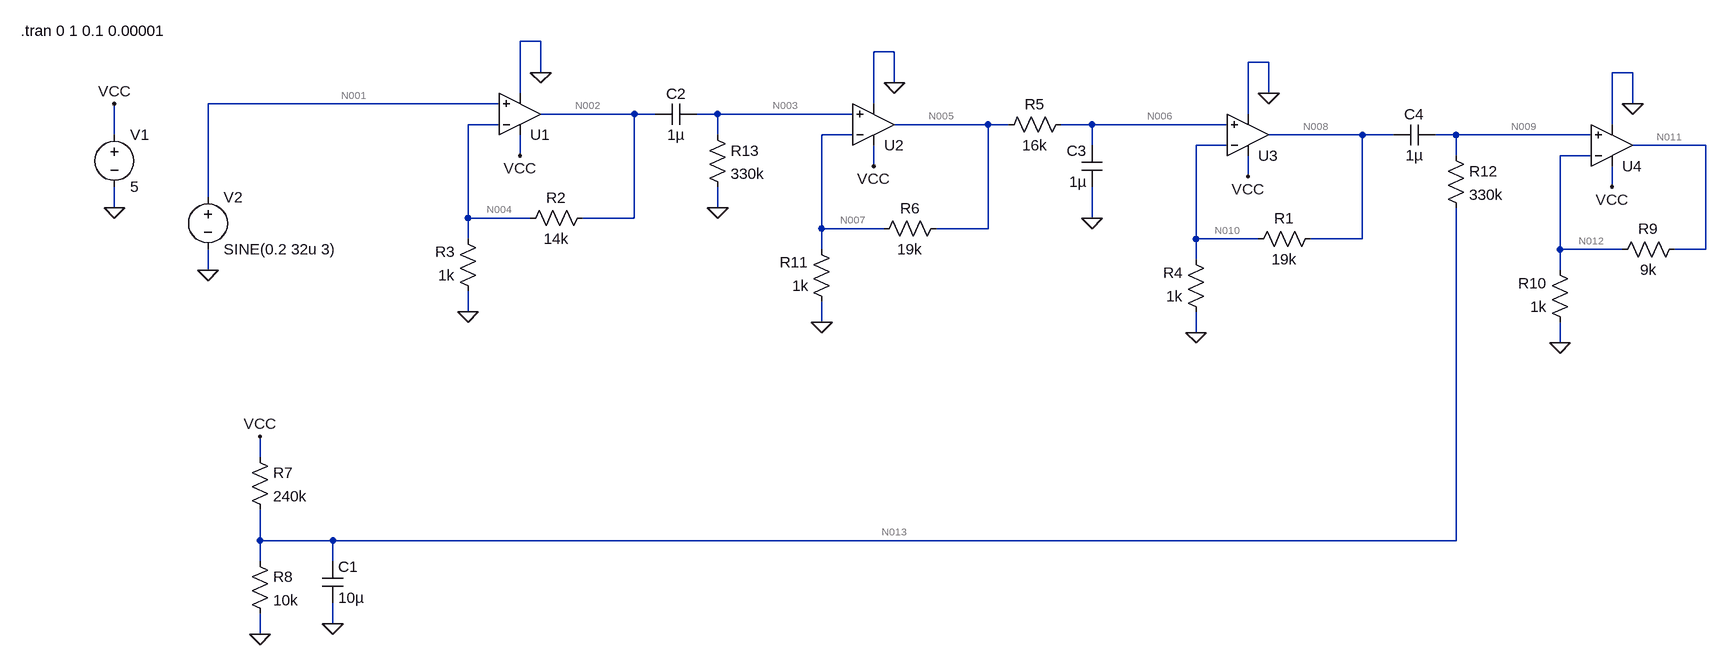
[diagram p0: schematic Draft1.asc]
Draft1.asc, the LTspice schematic file:
Version 4.1
SHEET 1 3092 772
WIRE 400 -288 368 -288
WIRE 944 -272 912 -272
WIRE 1520 -256 1488 -256
WIRE 400 -240 400 -288
WIRE 2080 -240 2048 -240
WIRE 944 -224 944 -272
WIRE 368 -208 368 -288
WIRE 1520 -208 1520 -256
WIRE 336 -192 -112 -192
WIRE 912 -192 912 -272
WIRE 2080 -192 2080 -240
WIRE 544 -176 400 -176
WIRE 576 -176 544 -176
WIRE 672 -176 640 -176
WIRE 880 -176 672 -176
WIRE 1488 -176 1488 -256
WIRE 336 -160 288 -160
WIRE 1088 -160 944 -160
WIRE 1120 -160 1088 -160
WIRE 1248 -160 1200 -160
WIRE 1456 -160 1248 -160
WIRE 2048 -160 2048 -240
WIRE -256 -144 -256 -192
WIRE 672 -144 672 -176
WIRE 880 -144 832 -144
WIRE 1664 -144 1520 -144
WIRE 1712 -144 1664 -144
WIRE 1808 -144 1776 -144
WIRE 2016 -144 1808 -144
WIRE 1248 -128 1248 -160
WIRE 1456 -128 1408 -128
WIRE 2192 -128 2080 -128
WIRE 368 -112 368 -144
WIRE 1808 -112 1808 -144
WIRE 2016 -112 1968 -112
WIRE 912 -96 912 -128
WIRE 1488 -80 1488 -112
WIRE 2048 -64 2048 -96
WIRE -112 -48 -112 -192
WIRE -256 -32 -256 -64
WIRE 672 -32 672 -64
WIRE 288 -16 288 -160
WIRE 384 -16 288 -16
WIRE 544 -16 544 -176
WIRE 544 -16 464 -16
WIRE 1248 -16 1248 -64
WIRE 832 0 832 -144
WIRE 928 0 832 0
WIRE 1088 0 1088 -160
WIRE 1088 0 1008 0
WIRE 288 16 288 -16
WIRE 1408 16 1408 -128
WIRE 1504 16 1408 16
WIRE 1664 16 1664 -144
WIRE 1664 16 1584 16
WIRE 832 32 832 0
WIRE 1968 32 1968 -112
WIRE 2064 32 1968 32
WIRE 2192 32 2192 -128
WIRE 2192 32 2144 32
WIRE 1408 48 1408 16
WIRE -112 64 -112 32
WIRE 1968 64 1968 32
WIRE 288 128 288 96
WIRE 832 144 832 112
WIRE 1408 160 1408 128
WIRE 1968 176 1968 144
WIRE -32 352 -32 320
WIRE -32 480 -32 432
WIRE 80 480 -32 480
WIRE 1808 480 1808 -32
WIRE 1808 480 80 480
WIRE -32 512 -32 480
WIRE 80 512 80 480
WIRE 80 608 80 576
WIRE -32 624 -32 592
FLAG -256 -32 0
FLAG -256 -192 VCC
FLAG -112 64 0
FLAG 368 -112 VCC
FLAG 400 -240 0
FLAG 288 128 0
FLAG 912 -96 VCC
FLAG 944 -224 0
FLAG 832 144 0
FLAG 1488 -80 VCC
FLAG 1520 -208 0
FLAG 1408 160 0
FLAG 1248 -16 0
FLAG 80 608 0
FLAG -32 624 0
FLAG -32 320 VCC
FLAG 672 -32 0
FLAG 2048 -64 VCC
FLAG 2080 -192 0
FLAG 1968 176 0
SYMBOL voltage -256 -160 R0
WINDOW 123 0 0 Left 0
WINDOW 39 0 0 Left 0
SYMATTR InstName V1
SYMATTR Value 5
SYMBOL voltage -112 -64 R0
WINDOW 123 0 0 Left 0
WINDOW 39 0 0 Left 0
SYMATTR InstName V2
SYMATTR Value SINE(0.2 32u 3)
SYMBOL res 480 -32 R90
WINDOW 0 0 56 VBottom 2
WINDOW 3 32 56 VTop 2
SYMATTR InstName R2
SYMATTR Value 14k
SYMBOL res 304 112 R180
WINDOW 0 36 76 Left 2
WINDOW 3 36 40 Left 2
SYMATTR InstName R3
SYMATTR Value 1k
SYMBOL res 1024 -16 R90
WINDOW 0 0 56 VBottom 2
WINDOW 3 32 56 VTop 2
SYMATTR InstName R6
SYMATTR Value 19k
SYMBOL res 848 128 R180
WINDOW 0 36 76 Left 2
WINDOW 3 36 40 Left 2
SYMATTR InstName R11
SYMATTR Value 1k
SYMBOL cap 640 -192 R90
WINDOW 0 0 32 VBottom 2
WINDOW 3 32 32 VTop 2
SYMATTR InstName C2
SYMATTR Value 1µ
SYMBOL res 656 -160 R0
SYMATTR InstName R13
SYMATTR Value 330k
SYMBOL OpAmps\\UniversalOpAmp2 368 -176 M180
SYMATTR InstName U1
SYMBOL OpAmps\\UniversalOpAmp2 912 -160 M180
SYMATTR InstName U2
SYMBOL res 1600 0 R90
WINDOW 0 0 56 VBottom 2
WINDOW 3 32 56 VTop 2
SYMATTR InstName R1
SYMATTR Value 19k
SYMBOL res 1424 144 R180
WINDOW 0 36 76 Left 2
WINDOW 3 36 40 Left 2
SYMATTR InstName R4
SYMATTR Value 1k
SYMBOL OpAmps\\UniversalOpAmp2 1488 -144 M180
SYMATTR InstName U3
SYMBOL cap 1264 -64 R180
WINDOW 0 24 56 Left 2
WINDOW 3 24 8 Left 2
SYMATTR InstName C3
SYMATTR Value 1µ
SYMBOL res 1216 -176 R90
WINDOW 0 0 56 VBottom 2
WINDOW 3 32 56 VTop 2
SYMATTR InstName R5
SYMATTR Value 16k
SYMBOL res -48 336 R0
SYMATTR InstName R7
SYMATTR Value 240k
SYMBOL res -48 496 R0
SYMATTR InstName R8
SYMATTR Value 10k
SYMBOL cap 64 512 R0
SYMATTR InstName C1
SYMATTR Value 10µ
SYMBOL res 2160 16 R90
WINDOW 0 0 56 VBottom 2
WINDOW 3 32 56 VTop 2
SYMATTR InstName R9
SYMATTR Value 9k
SYMBOL res 1984 160 R180
WINDOW 0 36 76 Left 2
WINDOW 3 36 40 Left 2
SYMATTR InstName R10
SYMATTR Value 1k
SYMBOL cap 1776 -160 R90
WINDOW 0 0 32 VBottom 2
WINDOW 3 32 32 VTop 2
SYMATTR InstName C4
SYMATTR Value 1µ
SYMBOL res 1792 -128 R0
SYMATTR InstName R12
SYMATTR Value 330k
SYMBOL OpAmps\\UniversalOpAmp2 2048 -128 M180
SYMATTR InstName U4
TEXT -400 -304 Left 2 !.tran 0 1 0.1 0.00001

The netlist it stands for:
* Draft1.asc
V1 VCC 0 5
V2 N001 0 SINE(0.2 32u 3)
R2 N002 N004 14k
R3 0 N004 1k
R6 N005 N007 19k
R11 0 N007 1k
C2 N003 N002 1µ
R13 N003 0 330k
X§U1 N001 N004 VCC 0 N002 level2 Avol=1Meg GBW=10Meg Slew=10Meg Ilimit=25m Rail=0 Vos=0 En=0 Enk=0 In=0 Ink=0 Rin=500Meg  ; pins In+ In- V+ V- OUT
X§U2 N003 N007 VCC 0 N005 level2 Avol=1Meg GBW=10Meg Slew=10Meg Ilimit=25m Rail=0 Vos=0 En=0 Enk=0 In=0 Ink=0 Rin=500Meg  ; pins In+ In- V+ V- OUT
R1 N008 N010 19k
R4 0 N010 1k
X§U3 N006 N010 VCC 0 N008 level2 Avol=1Meg GBW=10Meg Slew=10Meg Ilimit=25m Rail=0 Vos=0 En=0 Enk=0 In=0 Ink=0 Rin=500Meg  ; pins In+ In- V+ V- OUT
C3 0 N006 1µ
R5 N006 N005 16k
R7 VCC N013 240k
R8 N013 0 10k
C1 N013 0 10µ
R9 N011 N012 9k
R10 0 N012 1k
C4 N009 N008 1µ
R12 N009 N013 330k
X§U4 N009 N012 VCC 0 N011 level2 Avol=1Meg GBW=10Meg Slew=10Meg Ilimit=25m Rail=0 Vos=0 En=0 Enk=0 In=0 Ink=0 Rin=500Meg  ; pins In+ In- V+ V- OUT
.tran 0 1 0.1 0.00001
.lib UniversalOpAmp2.lib
.backanno
.end

* Results of the author's LTspice run, read from the files saved beside the schematic
* Operating Point, zero values left out:
*   V(n001) = 200 mV
*   V(n002) = 3 V
*   V(n003) = 1.649 mV
*   V(n004) = 200 mV
*   V(n005) = 32.95 mV
*   V(n006) = 33.03 mV
*   V(n007) = 1.652 mV
*   V(n008) = 660.6 mV
*   V(n009) = 201.6 mV
*   V(n010) = 33.03 mV
*   V(n011) = 2.016 V
*   V(n012) = 201.6 mV
*   V(n013) = 200 mV
*   V(vcc) = 5 V
*   I(R1) = 33.03 µA
*   I(R10) = -201.6 µA
*   I(R11) = -1.652 µA
*   I(R12) = 4.597 nA
*   I(R13) = 4.997 nA
*   I(R2) = 200 µA
*   I(R3) = -200 µA
*   I(R4) = -33.03 µA
*   I(R5) = 4.934 nA
*   I(R6) = 1.647 µA
*   I(R7) = 20 µA
*   I(R8) = 20 µA
*   I(R9) = 201.6 µA
*   I(V1) = -978.5 µA
*   I(V2) = 4.6 nA
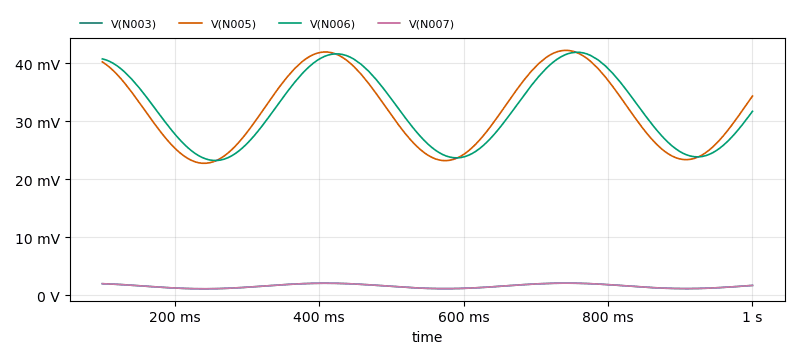
[diagram p1: Transient Analysis of Draft1.asc, plotted from the saved traces]
* Transient Analysis, 1 run:
*   V(N003): min 1.139 mV, max 2.115 mV, average 1.589 mV, rms 1.623 mV, last 1.721 mV
*   V(N005): min 22.78 mV, max 42.25 mV, average 31.77 mV, rms 32.43 mV, last 34.38 mV
*   V(N006): min 23.26 mV, max 41.93 mV, average 32.01 mV, rms 32.63 mV, last 31.75 mV
*   V(N007): min 1.144 mV, max 2.117 mV, average 1.593 mV, rms 1.626 mV, last 1.724 mV